# Altium project PCB_Project1.PrjPCB
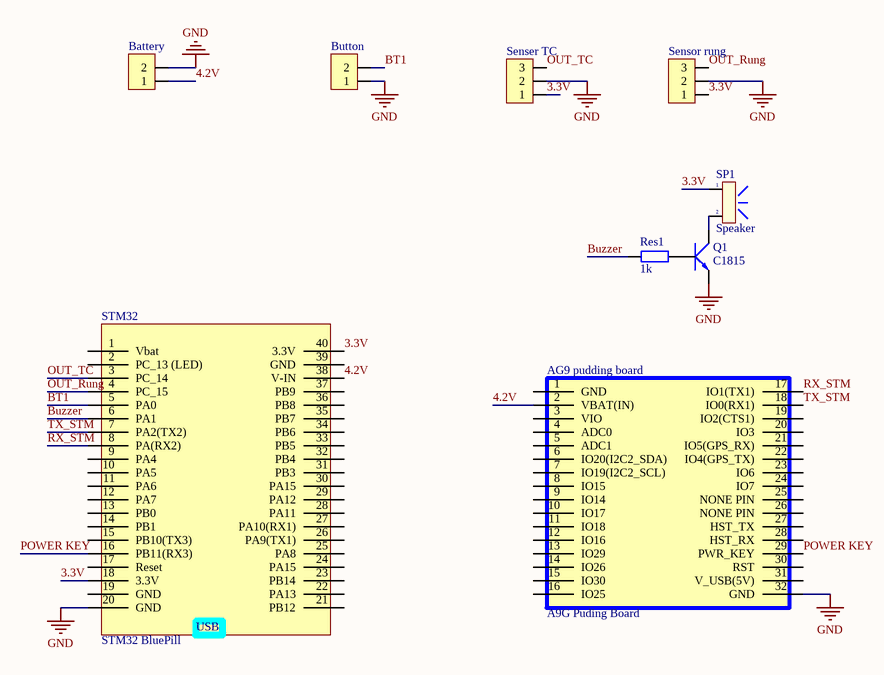
[diagram p0: Schematic.SchDoc]
1 sheet, 9 parts. Net scope: global (net labels, ports and power ports of the same name join across sheets).
Board file: PCB.PcbDoc

## Sheet Schematic.SchDoc
size A

### Parts
AG9_pudding_board  A9G Puding Board  [Pudding Board Sim A9G]
Battery  (no value)  [Header2]
Button  (no value)  [Header2]
Q1  C1815  [SOT23B]
Res1  1k  [SM-RES-0805]
Senser_TC  (no value)  [Header3]
Sensor_rung  (no value)  [Header3]
SP1  Speaker  [Speaker]
STM32  STM32 BluePill  [PCBComponent_1]

### Nets
GND: AG9_pudding_board.32(GND) Battery.2 Button.1 Q1.1(E) Senser_TC.2 Sensor_rung.2 STM32.20(GND)
3.3V: Senser_TC.1 Sensor_rung.1 SP1.1 STM32.18(3.3V) STM32.40(3.3V)
4.2V: AG9_pudding_board.2(VBAT(IN)) Battery.1 STM32.38(V-IN)
BT1: Button.2 STM32.5(PA0)
Buzzer: Res1.1 STM32.6(PA1)
OUT_Rung: Sensor_rung.3 STM32.4(PC_15)
OUT_TC: Senser_TC.3 STM32.3(PC_14)
POWER KEY: AG9_pudding_board.29(PWR_KEY) STM32.16(PB11(RX3))
RX_STM: AG9_pudding_board.17(IO1(TX1)) STM32.8(PA(RX2))
TX_STM: AG9_pudding_board.18(IO0(RX1)) STM32.7(PA2(TX2))
NetQ1_2: Q1.2(C) SP1.2
NetQ1_3: Q1.3(B) Res1.2

Not connected (* = marked no-connect by the designer): AG9_pudding_board 1(GND) 3(VIO) 4(ADC0) 5(ADC1) 6(IO20(I2C2_SDA)) 7(IO19(I2C2_SCL)) 8(IO15) 9(IO14) 10(IO17) 11(IO18) 12(IO16) 13(IO29) 14(IO26) 15(IO30) 16(IO25) 19(IO2(CTS1)) 20(IO3) 21(IO5(GPS_RX)) 22(IO4(GPS_TX)) 23(IO6) 24(IO7) 25(NONE_PIN) 26(NONE_PIN) 27(HST_TX) 28(HST_RX) 30(RST) 31(V_USB(5V)); STM32 1(Vbat) 2(PC_13_(LED)) 9(PA4) 10(PA5) 11(PA6) 12(PA7) 13(PB0) 14(PB1) 15(PB10(TX3)) 17(Reset) 19(GND) 21(PB12) 22(PA13) 23(PB14) 24(PA15) 25(PA8) 26(PA9(TX1)) 27(PA10(RX1)) 28(PA11) 29(PA12) 30(PA15) 31(PB3) 32(PB4) 33(PB5) 34(PB6) 35(PB7) 36(PB8) 37(PB9) 39(GND)

### Notes on the sheet
- (in symbol STM32 BluePill) USB

### Library data of the parts
Battery Button = Header2: Header IDC, 2 x 1 Pin Vertical 2.54mm Pitch (Non-Boxed, Male); Manufacturer: W¨¹rth Elektronik eiSos GmbH; partNo: 613002143121; ComponentLink1 Description: Manufacturer; ComponentLink2 Description: Datasheet; NoPins: 02; Created Date: 29 March 2013; ComponentLink1URL: http://www.we-online.com; ComponentLink2URL: http://katalog.we-online.de/em/datasheet/6130xx143121.pdf; Created by: Karrer Zheng
Q1 = C1815: NPN 600mW, ECB; Value: C1815
Res1 = R1/4W: Resistor 1/4W; Value: R1/4W - 1K
Senser_TC Sensor_rung = Header3: Header IDC, 3 x 1 Pin Vertical 2.54mm Pitch (Non-Boxed, Male); Manufacturer: W¨¹rth Elektronik eiSos GmbH; partNo: 613002143121; ComponentLink1 Description: Manufacturer; ComponentLink2 Description: Datasheet; NoPins: 02; Created Date: 29 March 2013; ComponentLink1URL: http://www.we-online.com; ComponentLink2URL: http://katalog.we-online.de/em/datasheet/6130xx143121.pdf; Created by: Karrer Zheng
SP1 = SPK: Speaker Chip; Value: Speaker Chip